# Altium schematic sheet MB_RELAY.SchDoc
size A3
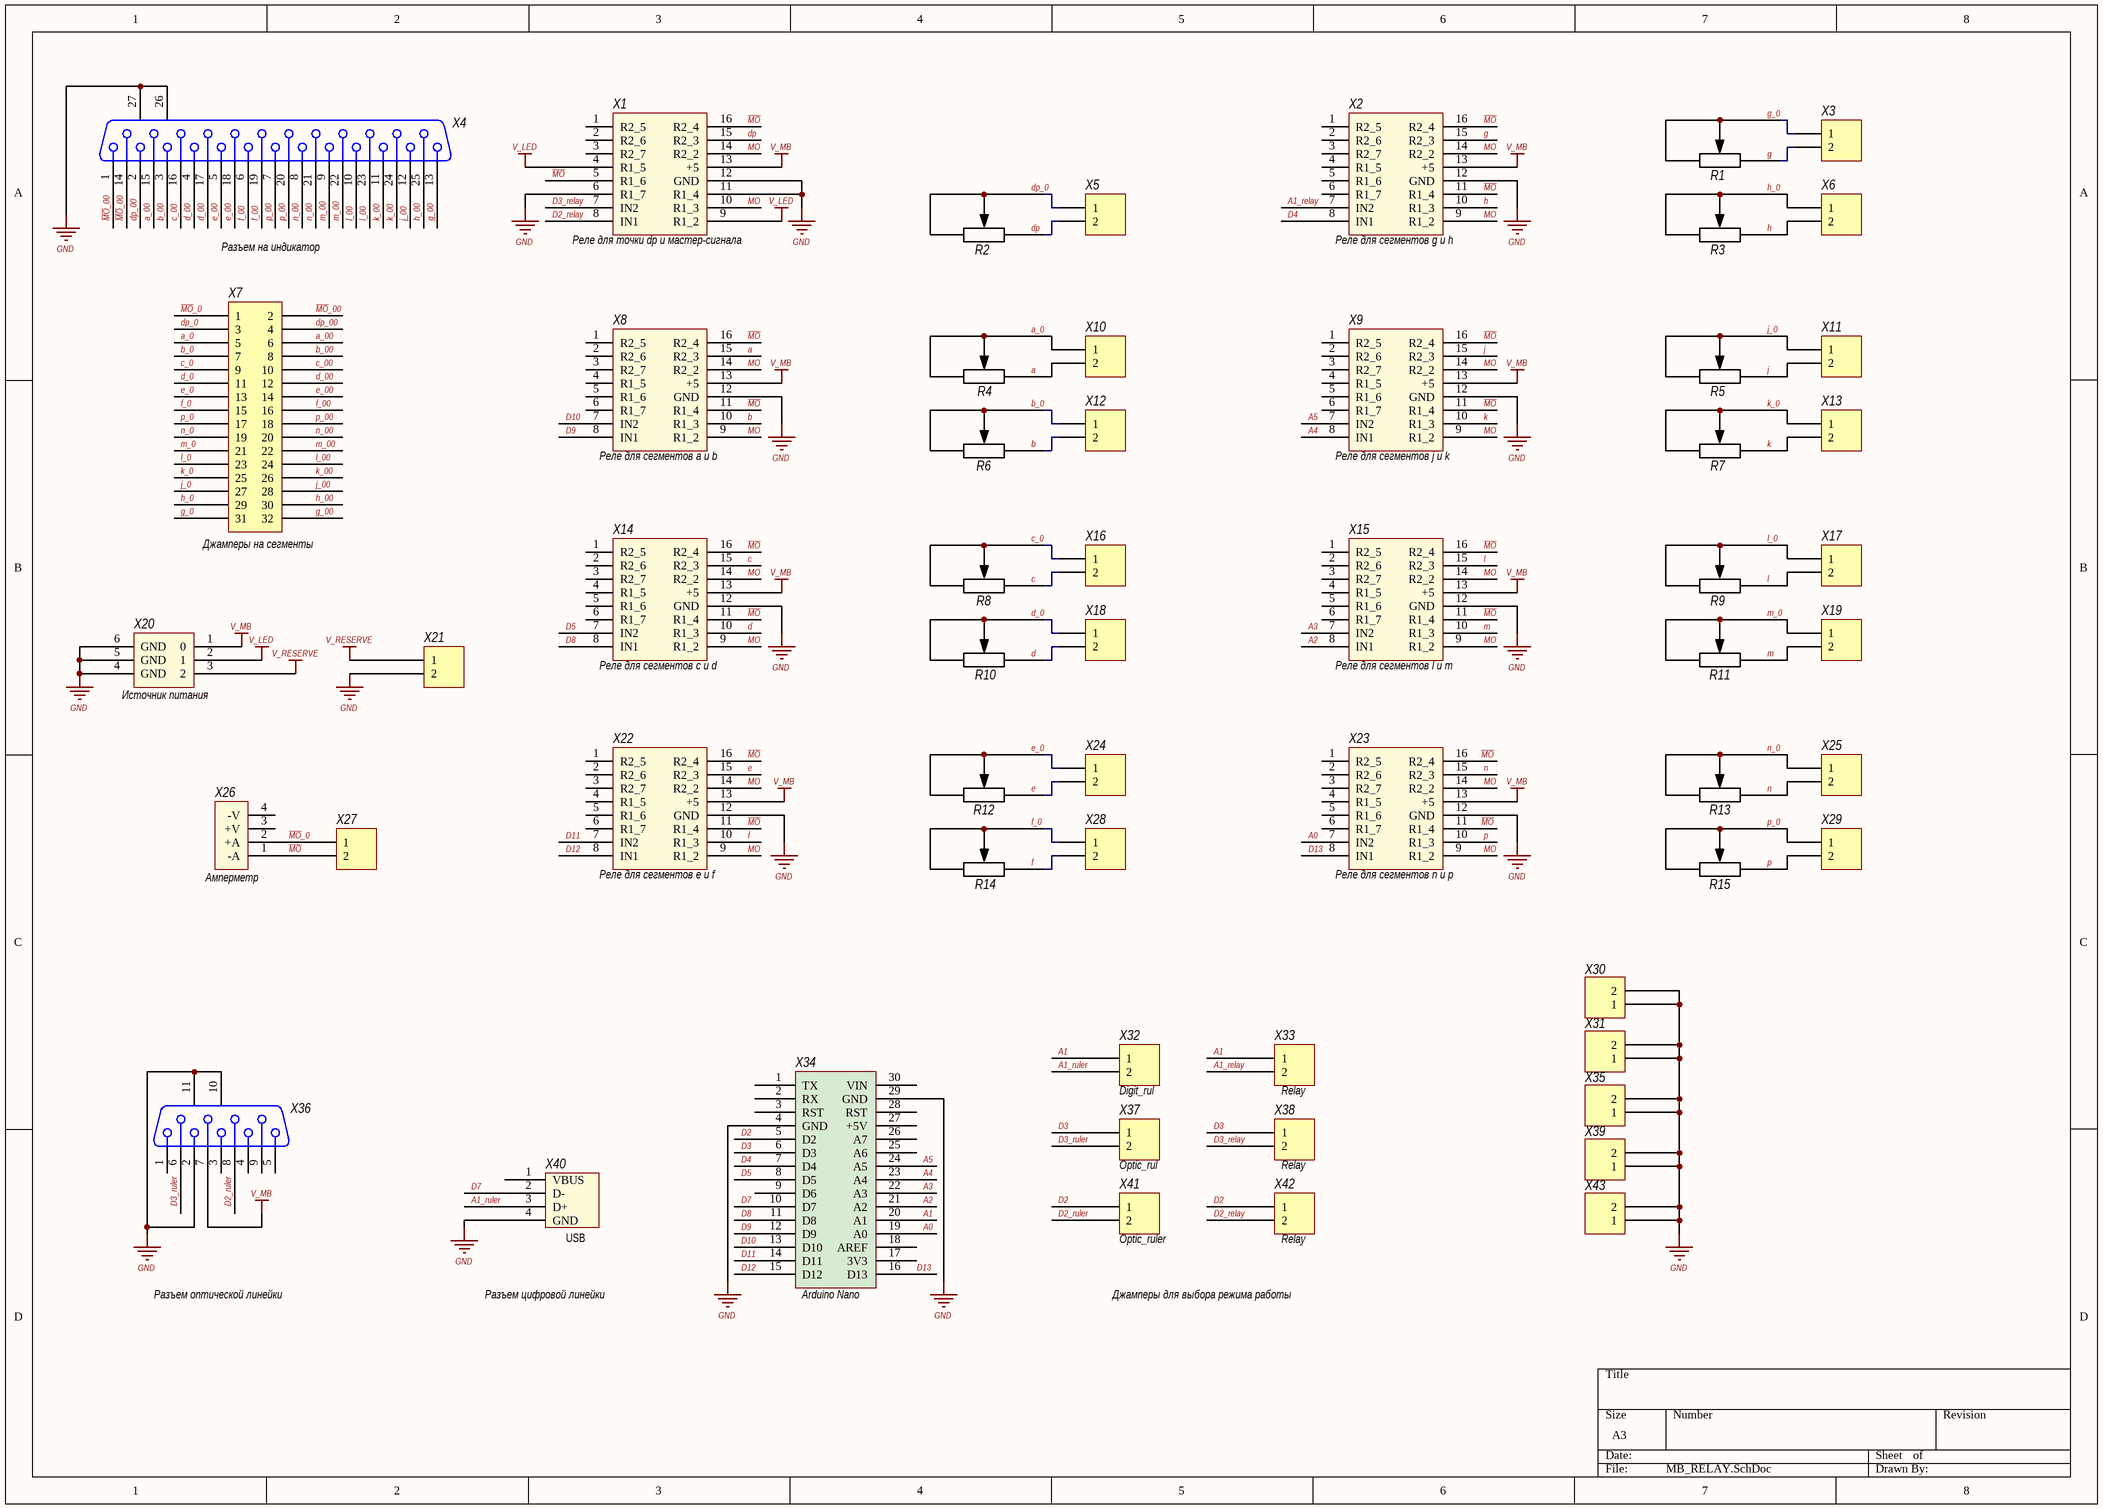
[diagram p0: MB_RELAY.SchDoc]

## Parts
R1  RES 3266W  [RES 3266W]  (value not drawn)
R2  RES 3266W  [RES 3266W]  (value not drawn)
R3  RES 3266W  [RES 3266W]  (value not drawn)
R4  Переменнный резистор для  [RES 3266W]  (value not drawn)
R5  RES 3266W  [RES 3266W]  (value not drawn)
R6  RES 3266W  [RES 3266W]  (value not drawn)
R7  RES 3266W  [RES 3266W]  (value not drawn)
R8  RES 3266W  [RES 3266W]  (value not drawn)
R9  RES 3266W  [RES 3266W]  (value not drawn)
R10  RES 3266W  [RES 3266W]  (value not drawn)
R11  RES 3266W  [RES 3266W]  (value not drawn)
R12  RES 3266W  [RES 3266W]  (value not drawn)
R13  RES 3266W  [RES 3266W]  (value not drawn)
R14  RES 3266W  [RES 3266W]  (value not drawn)
R15  RES 3266W  [RES 3266W]  (value not drawn)
X1  Реле для точки dp и мастер-сигнала  [MEZ_RELAY]
X2  Реле для сегментов g и h  [MEZ_RELAY]
X3  GND  [HDR1X2]  (value not drawn)
X4  D Connector 25  [DSUB1.385-2H25A]  (value not drawn)
X5  GND  [HDR1X2]  (value not drawn)
X6  GND  [HDR1X2]  (value not drawn)
X7  Header 16X2  [HDR2X16]  (value not drawn)
X8  Реле для сегментов a и b  [MEZ_RELAY]
X9  Реле для сегментов j и k  [MEZ_RELAY]
X10  Header 2  [HDR1X2]  (value not drawn)
X11  Header 2  [HDR1X2]  (value not drawn)
X12  Header 2  [HDR1X2]  (value not drawn)
X13  Header 2  [HDR1X2]  (value not drawn)
X14  Реле для сегментов c и d  [MEZ_RELAY]
X15  Реле для сегментов l и m  [MEZ_RELAY]
X16  Header 2  [HDR1X2]  (value not drawn)
X17  GND  [HDR1X2]  (value not drawn)
X18  Header 2  [HDR1X2]  (value not drawn)
X19  GND  [HDR1X2]  (value not drawn)
X20  Источник питания  [POWER]
X21  Header 2  [HDR1X2]  (value not drawn)
X22  Реле для сегментов e и f  [MEZ_RELAY]
X23  Реле для сегментов n и p  [MEZ_RELAY]
X24  GND  [HDR1X2]  (value not drawn)
X25  GND  [HDR1X2]  (value not drawn)
X26  Амперметр  [AMP_VOLTMETER]
X27  Header 2  [HDR1X2]  (value not drawn)
X28  GND  [HDR1X2]  (value not drawn)
X29  GND  [HDR1X2]  (value not drawn)
X30  Header 2  [HDR1X2]  (value not drawn)
X31  GND  [HDR1X2]  (value not drawn)
X32  Digit_rul  [HDR1X2]
X33  Relay  [HDR1X2]
X34  Arduino Nano  [PCBComponent_1]
X35  GND  [HDR1X2]  (value not drawn)
X36  D Connector 9  [DSUB1.385-2H9]  (value not drawn)
X37  Optic_rul  [HDR1X2]
X38  Relay  [HDR1X2]
X39  GND  [HDR1X2]  (value not drawn)
X40  USB  [USB]
X41  Optic_ruler  [HDR1X2]
X42  Relay  [HDR1X2]
X43  GND  [HDR1X2]  (value not drawn)

## Nets
GND: X1.6(R1_7) X1.11(R1_4) X1.12(GND) X2.12(GND) X4.26(MH1) X4.27(MH2) X8.12(GND) X9.12(GND) X14.12(GND) X15.12(GND) X20.4(GND) X20.5(GND) X20.6(GND) X21.2 X22.12(GND) X23.12(GND) X30.1 X30.2 X31.1 X31.2 X34.4(GND) X34.29(GND) X35.1 X35.2 X36.2 X36.10(MH1) X36.11(MH2) X39.1 X39.2 X40.4(GND) X43.1 X43.2
V_LED: X1.4(R1_5) X1.9(R1_2) X20.2(1)
V_MB: X1.13(+5) X2.13(+5) X8.13(+5) X9.13(+5) X14.13(+5) X15.13(+5) X20.1(0) X22.13(+5) X23.13(+5) X36.7
V_RESERVE: X20.3(2) X21.1
~{MO}: X1.5(R1_6) X1.16(R2_4) X2.11(R1_4) X2.16(R2_4) X8.11(R1_4) X8.16(R2_4) X9.11(R1_4) X9.16(R2_4) X14.11(R1_4) X14.16(R2_4) X15.11(R1_4) X15.16(R2_4) X22.11(R1_4) X22.16(R2_4) X23.11(R1_4) X23.16(R2_4) X26.1(-A) X27.2
~{MO}_0: X7.1 X26.2(+A) X27.1
~{MO}_00: X4.1 X4.14 X7.2
a: R4.3 X8.15(R2_3) X10.2
A0: X23.7(IN2) X34.19(A0)
A1: X32.1 X33.1 X34.20(A1)
A1_relay: X2.7(IN2) X33.2
A1_ruler: X32.2 X40.3(D+)
A2: X15.8(IN1) X34.21(A2)
A3: X15.7(IN2) X34.22(A3)
A4: X9.8(IN1) X34.23(A4)
A5: X9.7(IN2) X34.24(A5)
a_0: R4.1 R4.2 X7.5 X10.1
a_00: X4.15 X7.6
b: R6.3 X8.10(R1_3) X12.2
b_0: R6.1 R6.2 X7.7 X12.1
b_00: X4.3 X7.8
c: R8.3 X14.15(R2_3) X16.2
c_0: R8.1 R8.2 X7.9 X16.1
c_00: X4.16 X7.10
d: R10.3 X14.10(R1_3) X18.2
D2: X34.5(D2) X41.1 X42.1
D2_relay: X1.8(IN1) X42.2
D2_ruler: X36.8 X41.2
D3: X34.6(D3) X37.1 X38.1
D3_relay: X1.7(IN2) X38.2
D3_ruler: X36.6 X37.2
D4: X2.8(IN1) X34.7(D4)
D5: X14.7(IN2) X34.8(D5)
D7: X34.10(D7) X40.2(D-)
D8: X14.8(IN1) X34.11(D8)
D9: X8.8(IN1) X34.12(D9)
D10: X8.7(IN2) X34.13(D10)
D11: X22.7(IN2) X34.14(D11)
D12: X22.8(IN1) X34.15(D12)
D13: X23.8(IN1) X34.16(D13)
d_0: R10.1 R10.2 X7.11 X18.1
d_00: X4.4 X4.17 X7.12
dp: R2.3 X1.15(R2_3) X5.2
dp_0: R2.1 R2.2 X5.1 X7.3
dp_00: X4.2 X7.4
e: R12.3 X22.15(R2_3) X24.2
e_0: R12.1 R12.2 X7.13 X24.1
e_00: X4.5 X4.18 X7.14
f: R14.3 X22.10(R1_3) X28.2
f_0: R14.1 R14.2 X7.15 X28.1
f_00: X4.6 X4.19 X7.16
g: R1.3 X2.15(R2_3) X3.2
g_0: R1.1 R1.2 X3.1 X7.31
g_00: X4.13 X7.32
h: R3.3 X2.10(R1_3) X6.2
h_0: R3.1 R3.2 X6.1 X7.29
h_00: X4.25 X7.30
j: R5.3 X9.15(R2_3) X11.2
j_0: R5.1 R5.2 X7.27 X11.1
j_00: X4.12 X7.28
k: R7.3 X9.10(R1_3) X13.2
k_0: R7.1 R7.2 X7.25 X13.1
k_00: X4.11 X4.24 X7.26
l: R9.3 X15.15(R2_3) X17.2
l_0: R9.1 R9.2 X7.23 X17.1
l_00: X4.10 X4.23 X7.24
m: R11.3 X15.10(R1_3) X19.2
m_0: R11.1 R11.2 X7.21 X19.1
m_00: X4.9 X4.22 X7.22
MO: X1.10(R1_3) X1.14(R2_2) X2.9(R1_2) X2.14(R2_2) X8.9(R1_2) X8.14(R2_2) X9.9(R1_2) X9.14(R2_2) X14.9(R1_2) X14.14(R2_2) X15.9(R1_2) X15.14(R2_2) X22.9(R1_2) X22.14(R2_2) X23.9(R1_2) X23.14(R2_2)
n: R13.3 X23.15(R2_3) X25.2
n_0: R13.1 R13.2 X7.19 X25.1
n_00: X4.8 X4.21 X7.20
p: R15.3 X23.10(R1_3) X29.2
p_0: R15.1 R15.2 X7.17 X29.1
p_00: X4.7 X4.20 X7.18

Not connected (* = marked no-connect by the designer): X1 1(R2_5) 2(R2_6) 3(R2_7); X2 1(R2_5) 2(R2_6) 3(R2_7) 4(R1_5) 5(R1_6) 6(R1_7); X8 1(R2_5) 2(R2_6) 3(R2_7) 4(R1_5) 5(R1_6) 6(R1_7); X9 1(R2_5) 2(R2_6) 3(R2_7) 4(R1_5) 5(R1_6) 6(R1_7); X14 1(R2_5) 2(R2_6) 3(R2_7) 4(R1_5) 5(R1_6) 6(R1_7); X15 1(R2_5) 2(R2_6) 3(R2_7) 4(R1_5) 5(R1_6) 6(R1_7); X22 1(R2_5) 2(R2_6) 3(R2_7) 4(R1_5) 5(R1_6) 6(R1_7); X23 1(R2_5) 2(R2_6) 3(R2_7) 4(R1_5) 5(R1_6) 6(R1_7); X26 3(+V) 4(-V); X34 1(TX) 2(RX) 3(RST) 9(D6) 17(3V3) 18(AREF) 25(A6) 26(A7) 27(+5V) 28(RST) 30(VIN); X36 1 3 4 5 9; X40 1(VBUS)

## Notes on the sheet
- Разъем на индикатор
- (near X7) Джамперы на сегменты
- Разъем оптической линейки
- Разъем цифровой линейки
- Джамперы для выбора режима работы

## Library data of the parts
R4 = RES 3266W
X1 X2 X8 X9 X14 X15 X22 X23 = MEZ_RELAY
X3 X5 X6 X10-X13 X16-X19 X21 X24 X25 X27-X33 X35 X37-X39 X41-X43 = Header 2: Header, 2-Pin; LatestRevisionDate: 17-Jul-2002; LatestRevisionNote: Re-released for DXP Platform.; Publisher: Altium Limited
X4 = D Connector 25: Receptacle Assembly, 25 Position, Right Angle; PackageDocument: U; Positions: 25; Published: 15-Jun-2001; LatestRevisionDate: 17-Jul-2002; LatestRevisionNote: Re-released for DXP Platform.; DatasheetDocument: 19-Mar-1999; PackageReference: 787202; Publisher: Altium Limited; Orientation: Right Angle; Gender: Receptacle
X7 = Header 16X2: Header, 16-Pin, Dual row; LatestRevisionDate: 17-Jul-2002; LatestRevisionNote: Re-released for DXP Platform.; Publisher: Altium Limited
X20 = POWER
X26 = AMP_VOLTMETR
X34 = Component_1
X36 = D Connector 9: Receptacle Assembly, 9 Position, Right Angle; PackageDocument: O; Positions: 9; Published: 15-Jun-2001; LatestRevisionDate: 17-Jul-2002; LatestRevisionNote: Re-released for DXP Platform.; DatasheetDocument: 1-Sep-1999; PackageReference: 788750; Publisher: Altium Limited; Orientation: Right Angle; Gender: Receptacle